# Altium schematic sheet Power_Input.SchDoc: Scuba Doo Power Input
size B; Organization: CWRUbotix; Address1: 10900 Euclid Avenue; Address2: Cleveland, OH 44106; Address3: USA; SheetNumber: 1; SheetTotal: 7
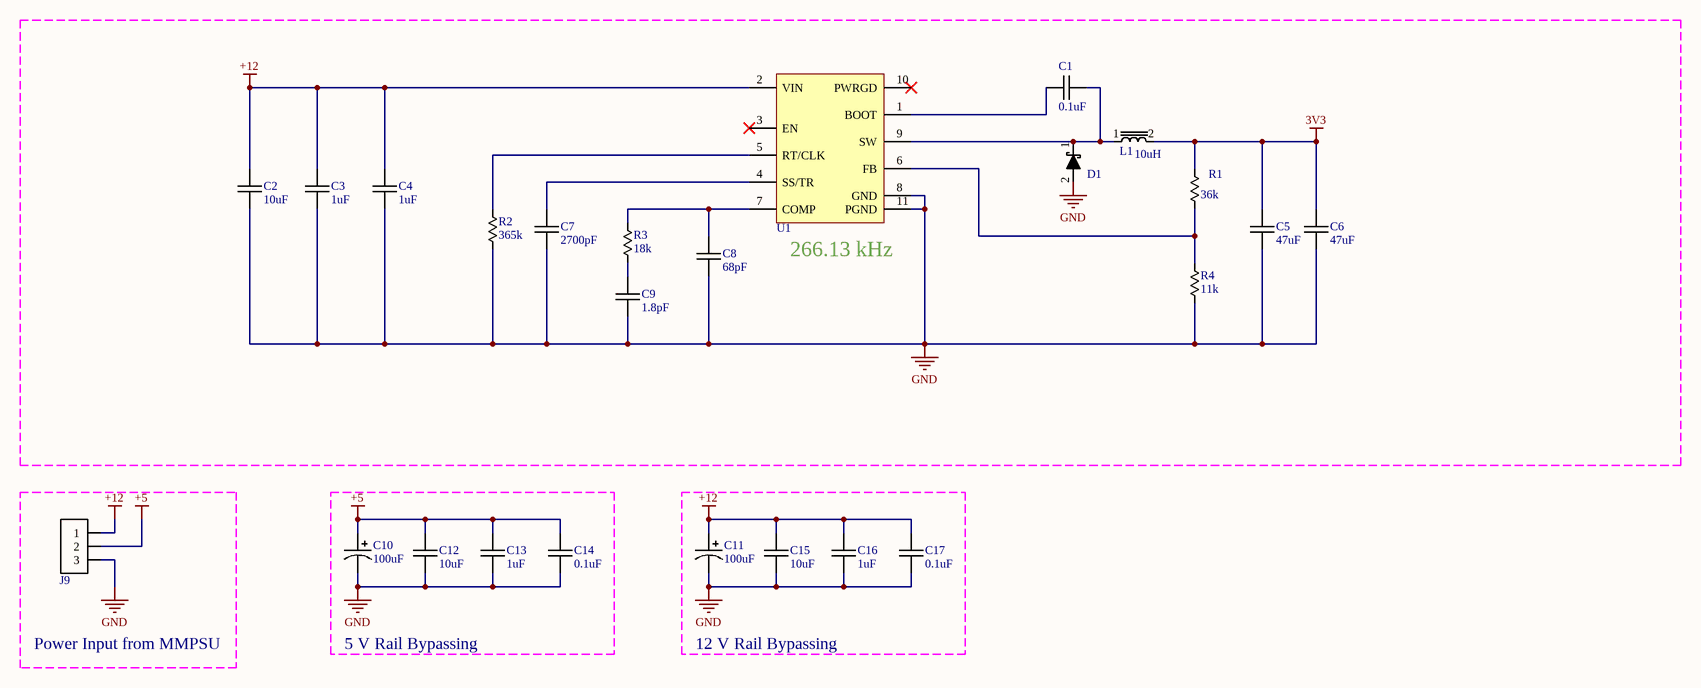
[diagram p0: Power_Input.SchDoc]

## Parts
C1  0.1uF  [chip_0603]
C2  10uF  [chip_1206]
C3  1uF  [chip_0805]
C4  1uF  [chip_0805]
C5  47uF  [chip_1210]
C6  47uF  [chip_1210]
C7  2700pF  [chip_0603]
C8  68pF  [chip_0603]
C9  1.8pF  [chip_0603]
C10  100uF  [can_2_0]
C11  100uF  [can_2_0]
C12  10uF  [chip_0805]
C13  1uF  [chip_0805]
C14  0.1uF  [chip_0603]
C15  10uF  [chip_0805]
C16  1uF  [chip_0805]
C17  0.1uF  [chip_0603]
D1  diode_2  [sod123_0]  (value not drawn)
J9  conn-3x1_0  [PHOENIX_1991105]  (value not drawn)
L1  10uH  [chip_0805]
R1  36k  [chip_0603]
R2  365k  [chip_0603]
R3  18k  [chip_0603]
R4  11k  [chip_0603]
U1  TPS54361  [WSON-10_0]  (value not drawn)

## Blocks framed on the sheet
266.13 kHz: C1-C9 D1 L1 R1-R4 U1
Power Input from MMPSU: J9
5 V Rail Bypassing: C10 C12-C14
12 V Rail Bypassing: C11 C15-C17

## Nets
3V3: C5.1 C6.1 L1.2 R1.1
+5: C10.1 C12.1 C13.1 C14.1 J9.2
+12: C2.1 C3.1 C4.1 C11.1 C15.1 C16.1 C17.1 J9.1 U1.2(VIN)
GND: C2.2 C3.2 C4.2 C5.2 C6.2 C7.2 C8.2 C9.2 C10.2 C11.2 C12.2 C13.2 C14.2 C15.2 C16.2 C17.2 D1.2 J9.3 R2.2 R4.2 U1.8(GND) U1.11(PGND)
NetC1_1: C1.1 U1.1(BOOT)
NetC1_2: C1.2 D1.1 L1.1 U1.9(SW)
NetC7_1: C7.1 U1.4(SS/TR)
NetC8_1: C8.1 R3.1 U1.7(COMP)
NetC9_1: C9.1 R3.2
NetR1_2: R1.2 R4.1 U1.6(FB)
NetR2_1: R2.1 U1.5(RT/CLK)

Not connected (* = marked no-connect by the designer): U1 3(EN)* 10(PWRGD)*

## Notes on the sheet
- Title
- Size:
- B
- Number:
- Revision:
- Date:
- Sheet
- of

## Library data of the parts
C1 C14 C17 = CAP-00542: CAP, 0.1uF, ±10%, 16V, X7R, 0603; Manufacturer: Murata; Part Number: CAP-00542; Capacitance: 0.1uF; Tolerance: ±10%; Voltage Rating: 16V; Type: X7R
C2 = CAP-00539: CAP, 10uF, ±10%, 25V, X7R, 1206; Manufacturer: Samsung; Manufacturer PN: CL31B106KAHNNNE; Part Number: CAP-00539; Capacitance: 10uF; Tolerance: ±10%; Voltage Rating: 25V; Type: X7R; Distributor Link: https://www.digikey.com/en/products/detail/samsung-electro-mechanics/CL31B106KAHNNNE/3887462
C3 C4 = CAP-00108: CAP, 1uF, 10%, 25V, X7R, 0805; Manufacturer: Murata; Manufacturer PN: GRM21BR71E105KA99L; Part Number: CAP-00108; Capacitance: 1uF; Tolerance: 10%; Voltage Rating: 25V; Type: X7R
C5 C6 = CAP-00593: CAP, 47uF, ±20%, 10V, X7R, 1210; Manufacturer: Taiyo Yuden; Manufacturer PN: LMK325B7476MM-TR; Part Number: CAP-00593; Capacitance: 47uF; Tolerance: ±20%; Voltage Rating: 10V; Type: X7R; Cost: $1.06; Distributor Link: https://www.digikey.com/en/products/detail/taiyo-yuden/LMK325B7476MM-TR/2573870
C7 = CAP-00434: CAP, 2700pF, ±2%, 50V, C0G, 0603; Manufacturer: Murata; Manufacturer PN: GRM1885C1H272GA01D; Part Number: CAP-00434; Capacitance: 2700pF; Tolerance: ±2%; Voltage Rating: 50V; Type: C0G
C8 = CAP-00462: CAP, 68pF, ±2%, 50V, C0G, 0603; Manufacturer: Murata; Manufacturer PN: GRM1885C1H680GA01D; Part Number: CAP-00462; Capacitance: 68pF; Tolerance: ±2%; Voltage Rating: 50V; Type: C0G
C9 = CAP-00384: CAP, 1.8pF, ±0.1pF, 50V, C0G, 0603; Manufacturer: Murata; Manufacturer PN: GRM1885C1H1R8BA01D; Part Number: CAP-00384; Capacitance: 1.8pF; Tolerance: ±0.1pF; Voltage Rating: 50V; Type: C0G
C10 C11 = CAP-00238: CAP, 100uF, 20%, 10V, Al, Radial/Can; Manufacturer: Nichicon; Manufacturer PN: UVR1A101MDD; Part Number: CAP-00238; Capacitance: 100uF; Tolerance: 20%; Voltage Rating: 10V; Type: Al
C12 C15 = CAP-00131: CAP, 10uF, 10%, 10V, X7R, 0805; Manufacturer: Murata; Manufacturer PN: GRM21BR71A106KA73L; Part Number: CAP-00131; Capacitance: 10uF; Tolerance: 10%; Voltage Rating: 10V; Type: X7R
C13 C16 = CAP-00111: CAP, 1uF, 10%, 10V, X7R, 0805; Manufacturer: Murata; Manufacturer PN: GRM21BR71A105KA01L; Part Number: CAP-00111; Capacitance: 1uF; Tolerance: 10%; Voltage Rating: 10V; Type: X7R
D1 = DIO-00002: Dio Shtky, 2A, 0.43V, 30V, SOD-123; Manufacturer: ON Semi; Manufacturer PN: MBR230LSFT1G; Forward Voltage: 430mV; Type: Schottky; Part Number: DIO-00002; Reverse Breakdown Voltage: 30V; Current Rating: 2A
J9 = CONN-00097: Terminal Blk, 3 Pos, 20A, 5.0mm Pitch, Screwless, 12-24AWG; Manufacturer: Phoenix Contact; Manufacturer PN: 1991105; Positions per level: 3; Levels: 1; Part Number: CONN-00097; Type: Terminal Block; Cost: 1.8
L1 = MAG-00059: Ind, 10uH, 20%, 350mA, 0805; Manufacturer: TDK; Manufacturer PN: MLZ2012M100WT000; DCR: 611 mOhm; Part Number: MAG-00059; Inductance: 10uH; Tolerance: 20%; Current Rating: 350mA
R1 = RES-00449: RES SMD 36K OHM 1% 1/4W 0603; Manufacturer: Panasonic; Manufacturer PN: ERJ-PA3F3602V; Power Rating: 0.25W; Part Number: RES-00449; Resistance: 36k; Tolerance: 1%
R2 = RES-01182: RES SMD 365K OHM 1% 1/10W 0603; Manufacturer: Vishay Dale; Manufacturer PN: CRCW0603365KFKEA; Part Number: RES-01182; Resistance: 365k; Tolerance: ±1%; Power Rating: 1/10W; Cost: 0.1
R3 = RES-00760: RES SMD 18K OHM 1% 1/10W 0603; Manufacturer: Vishay Dale; Manufacturer PN: CRCW060318K0FKEA; Part Number: RES-00760; Resistance: 18k; Tolerance: ±1%; Power Rating: 1/10W; Cost: 0.1
R4 = RES-00314: RES SMD 11K OHM 1% 1/4W 0603; Manufacturer: Panasonic; Manufacturer PN: ERJ-PA3F1102V; Power Rating: 0.25W; Part Number: RES-00314; Resistance: 11k; Tolerance: 1%
U1 = PWREG-00078: REG, SW Buck Adj, 3A, 4.5-60V, 2.5MHz, TPS54361; Manufacturer: TI; Manufacturer PN: TPS54361DPRR; Voltage Range Out: 0.8-58.8V; Frequency: 100kHz-2.5MHz; Reg Type: SW Buck; Part Number: PWREG-00078; Voltage Range In: 4.5-60V; Max Current: 3A; Fixed/Adj: Adj